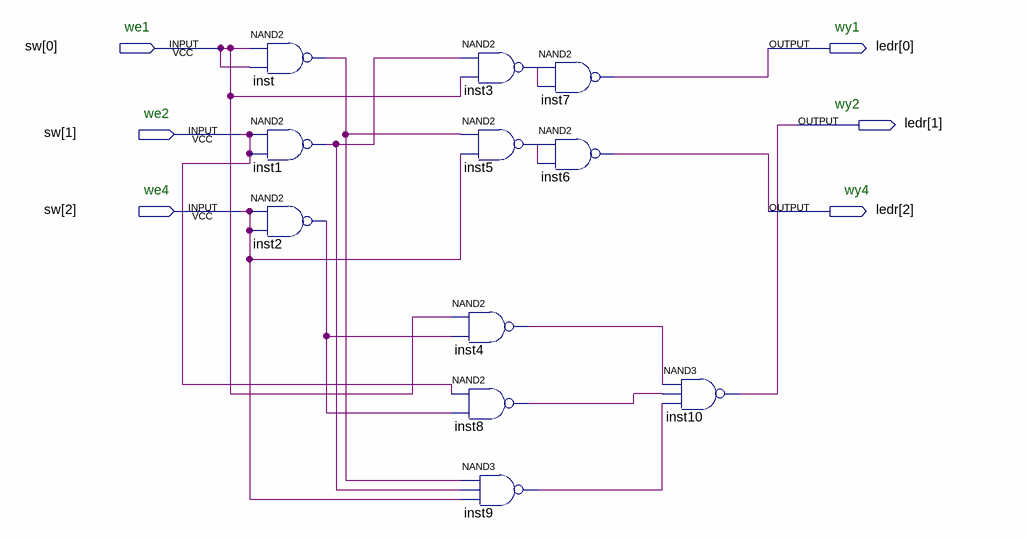
[diagram p0: schematic sheet]
// Quartus schematic lab1.bdf as structural Verilog: 11 symbols, 6 pins
module lab1 (
  input  [2:0] sw,
  output [2:0] ledr
);

  wire inst1_out, inst2_out, inst3_out, inst4_out, inst5_out, inst8_out, inst9_out, inst_out;

  nand inst (inst_out, sw[0], sw[0]);
  nand inst1 (inst1_out, sw[1], sw[1]);
  nand inst2 (inst2_out, sw[2], sw[2]);
  nand inst3 (inst3_out, inst1_out, sw[0]);
  nand inst5 (inst5_out, inst_out, sw[2]);
  nand inst4 (inst4_out, sw[0], inst2_out);
  nand inst8 (inst8_out, sw[1], inst2_out);
  nand inst9 (inst9_out, inst_out, inst1_out, sw[2]);
  nand inst7 (ledr[0], inst3_out, inst3_out);
  nand inst6 (ledr[2], inst5_out, inst5_out);
  nand inst10 (ledr[1], inst4_out, inst8_out, inst9_out);

  // Notes on the sheet:
  //   we1
  //   wy1
  //   wy2
  //   we2
  //   we4
  //   wy4
endmodule
